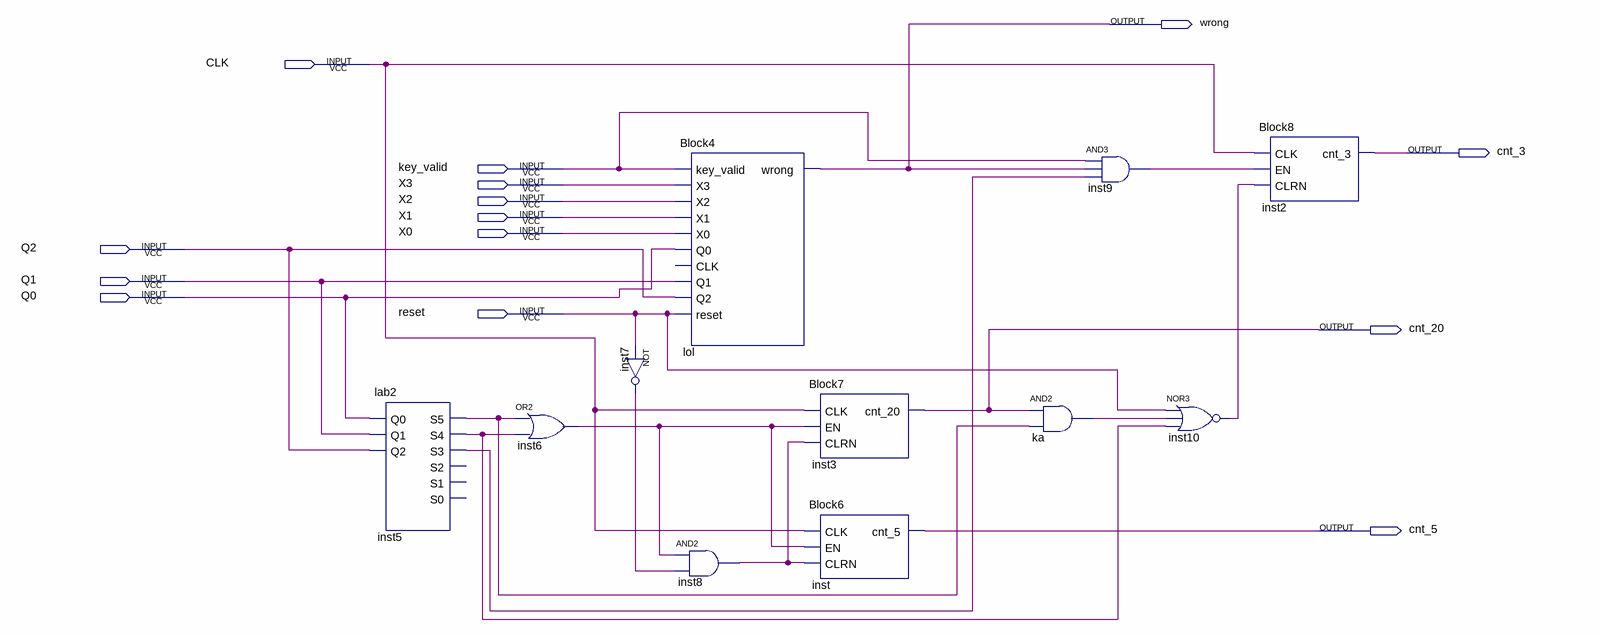
[diagram p0: schematic sheet]
// Quartus schematic Block9.bdf as structural Verilog: 11 symbols, 14 pins
module Block9 (
  input  CLK,
  input  key_valid,
  input  X3,
  input  X2,
  input  X1,
  input  X0,
  input  Q2,
  input  Q1,
  input  Q0,
  input  reset,
  output wrong,
  output cnt_3,
  output cnt_20,
  output cnt_5
);

  wire inst5_s3, inst5_s4, inst5_s5, inst6_out, inst7_out, inst8_out, inst9_out, inst10_out, ka_out;

  lab2 inst5 (.Q0(Q0), .Q1(Q1), .Q2(Q2), .S5(inst5_s5), .S4(inst5_s4), .S3(inst5_s3));  // open: S2, S1, S0
  or inst6 (inst6_out, inst5_s5, inst5_s4);
  not inst7 (inst7_out, reset);
  Block4 lol (
    .key_valid(key_valid), .X3(X3), .X2(X2), .X1(X1), .X0(X0), .Q0(Q0), .Q1(Q1), .Q2(Q2), .reset(reset),
    .wrong(wrong));  // open: CLK
  and inst8 (inst8_out, inst6_out, inst7_out);
  Block7 inst3 (.CLK(CLK), .EN(inst6_out), .CLRN(inst8_out), .cnt_20(cnt_20));
  Block6 inst (.CLK(CLK), .EN(inst6_out), .CLRN(inst8_out), .cnt_5(cnt_5));
  and ka (ka_out, cnt_20, inst5_s5);
  and inst9 (inst9_out, key_valid, wrong, inst5_s3);
  nor inst10 (inst10_out, reset, ka_out, inst5_s4);
  Block8 inst2 (.CLK(CLK), .EN(inst9_out), .CLRN(inst10_out), .cnt_3(cnt_3));
endmodule
